# Altium schematic sheet 5V-Regulator.SchDoc
size A; SheetNumber: 3; SheetTotal: 12
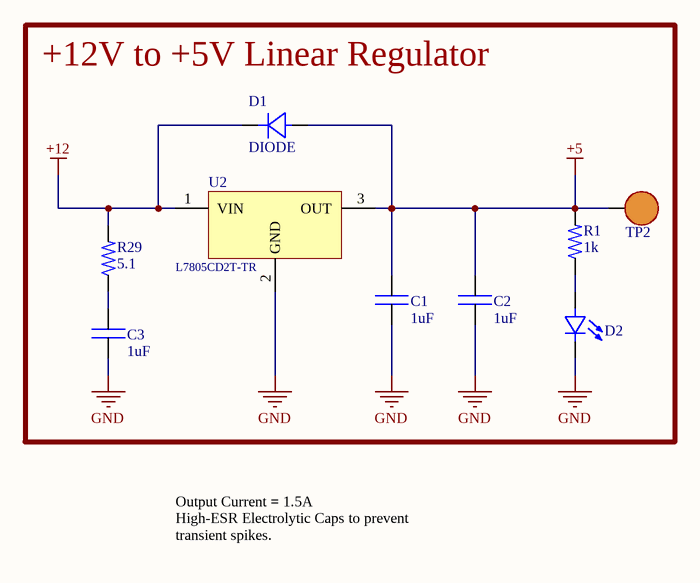
[diagram p0: 5V-Regulator.SchDoc]

## Parts
C1  value 1uF  [0402C]  (hidden comment: CAP)
C2  value 1uF  [0402C]  (hidden comment: CAP)
C3  value 1uF  [0402C]  (hidden comment: CAP)
D1  DIODE  [DO-214AC]
D2  LED - single  [LED - 0603]  (value not drawn)
R1  value 1k  [0402R]  (hidden comment: RES)
R29  value 5.1  [0805R]  (hidden comment: RES)
TP2  RCWCTE  [RCWCTE]  (value not drawn)
U2  L7805CD2T-TR  [D2PAK]

## Blocks framed on the sheet
+12V to +5V Linear Regulator: C1-C3 D1 D2 R1 R29 TP2 U2

## Nets
+5: C1.2 C2.2 D1.A R1.2 TP2.1 U2.3(OUT)
+12: D1.K R29.2 U2.1(VIN)
GND: C1.1 C2.1 C3.1 D2.2(C) U2.2(GND)
NetC3_2: C3.2 R29.1
NetD2_1: D2.1(A) R1.1

## Notes on the sheet
- Output Current = 1.5A
  High-ESR Electrolytic Caps to prevent transient spikes.

## Library data of the parts
C1-C3 = CAP: Capacitor; MFR: Murata Electronics; MFR PN: GRM155R61E105MA12D; Type: SMD; Vendor: *; Vendor PN: *; Vendor Link: *
D1 = DIODE: DIODE GEN PURP; MFR: Micro Commercial Co; MFR PN: GS1M-LTP; Type: SMD; Value: *
D2 = LED - single: LED; MFR: DNS; Type: SMD; Color: *; MFR PN: DNS
R1 = RES: Resistor; MFR PN: RC0402JR-071KL; MFR: YAGEO; Vendor: *; Vendor PN: *; Vendor Link: *; Type: SMD
R29 = RES: Resistor; MFR PN: ESR10EZPJ5R1; MFR: Rohm Semiconductor; Vendor: *; Vendor PN: *; Vendor Link: *; Type: SMD
TP2 = TEST POINT: Test Point, Surface Mount; MFR: KOA Speer Electronics, Inc.; MFR PN: RCWCTE; Type: SMD
U2 = LIN REG 5V 1.5A 35V: Linear Voltage Regulator IC Positive Fixed 1 Output 1.5A D2PAK; MFR: STMicroelectronics; MFR PN: L7805CD2T-TR; Type: SMD